# EAGLE design ponte_h_mosfet (EAGLE 6.5.0)
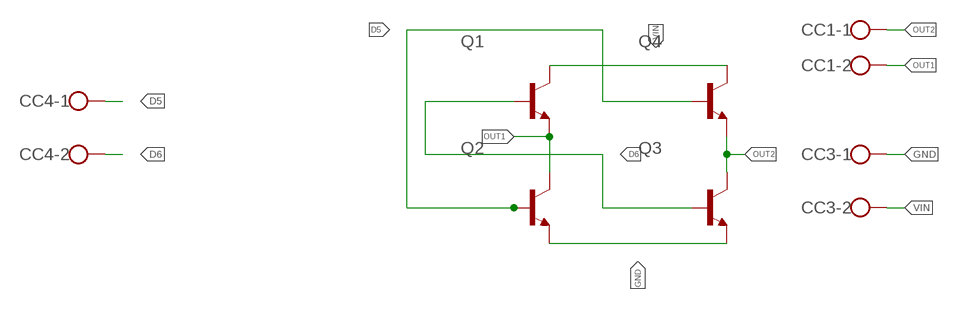
[diagram p0: schematic, sheet 1]

## Parts
CC1  W237-102  [W237-102]
CC3  W237-102  [W237-102]
CC4  W237-102  [W237-102]
Q1  -NPN-TO220V  [TO220V]
Q2  -NPN-TO220V  [TO220V]
Q3  -NPN-TO220V  [TO220V]
Q4  -NPN-TO220V  [TO220V]

## Nets
D5: CC4.1 Q2.1(B) Q4.1(B)
D6: CC4.2 Q1.1(B) Q3.1(B)
GND: CC3.1 Q2.3(E) Q3.3(E)
OUT1: CC1.2 Q1.3(E) Q2.2(C)
OUT2: CC1.1 Q3.2(C) Q4.3(E)
VIN: CC3.2 Q1.2(C) Q4.2(C)

## Library data of the parts
CC1 CC3 CC4 = con-wago-500:W237-102: WAGO SCREW CLAMP; MPN: 237-102; OC_FARNELL: unknown; OC_NEWARK: 70K9898
Q1-Q4 = transistor:*-NPN-: NPN Transistror BF959 corrected 2008.03.06

## Board
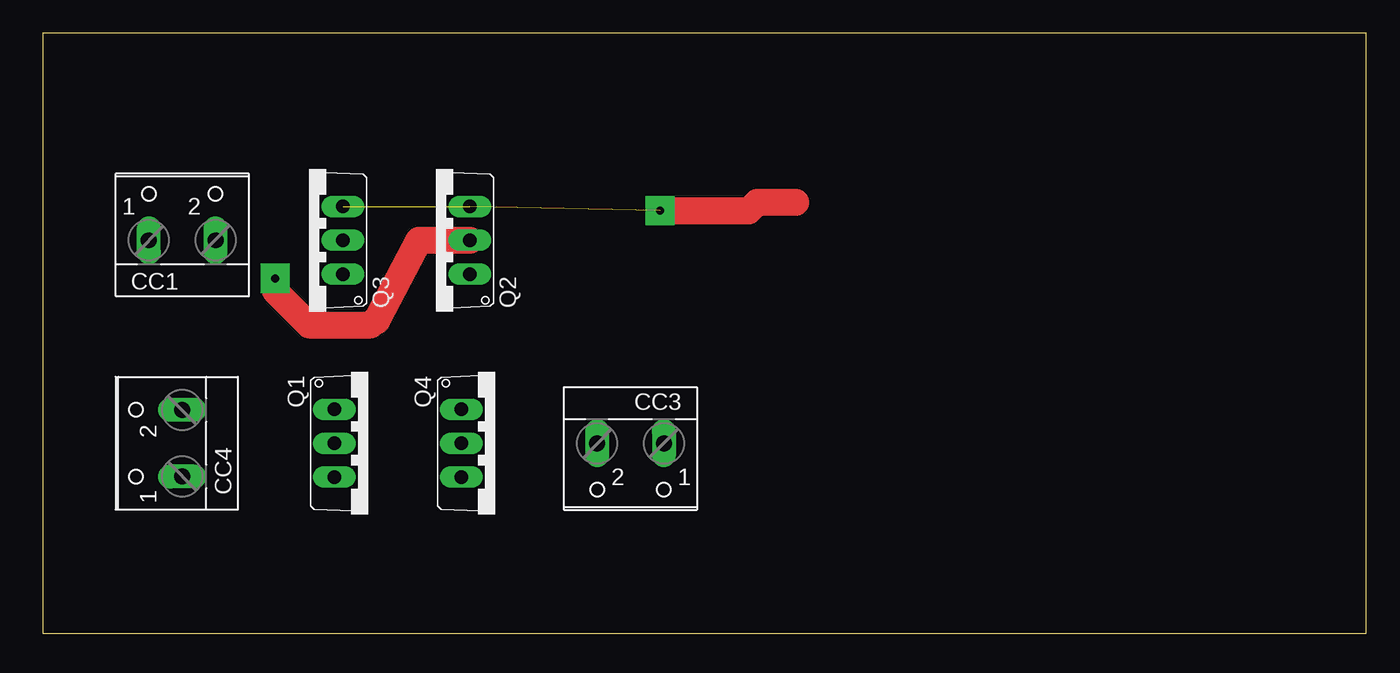
[diagram p1: board, top side]
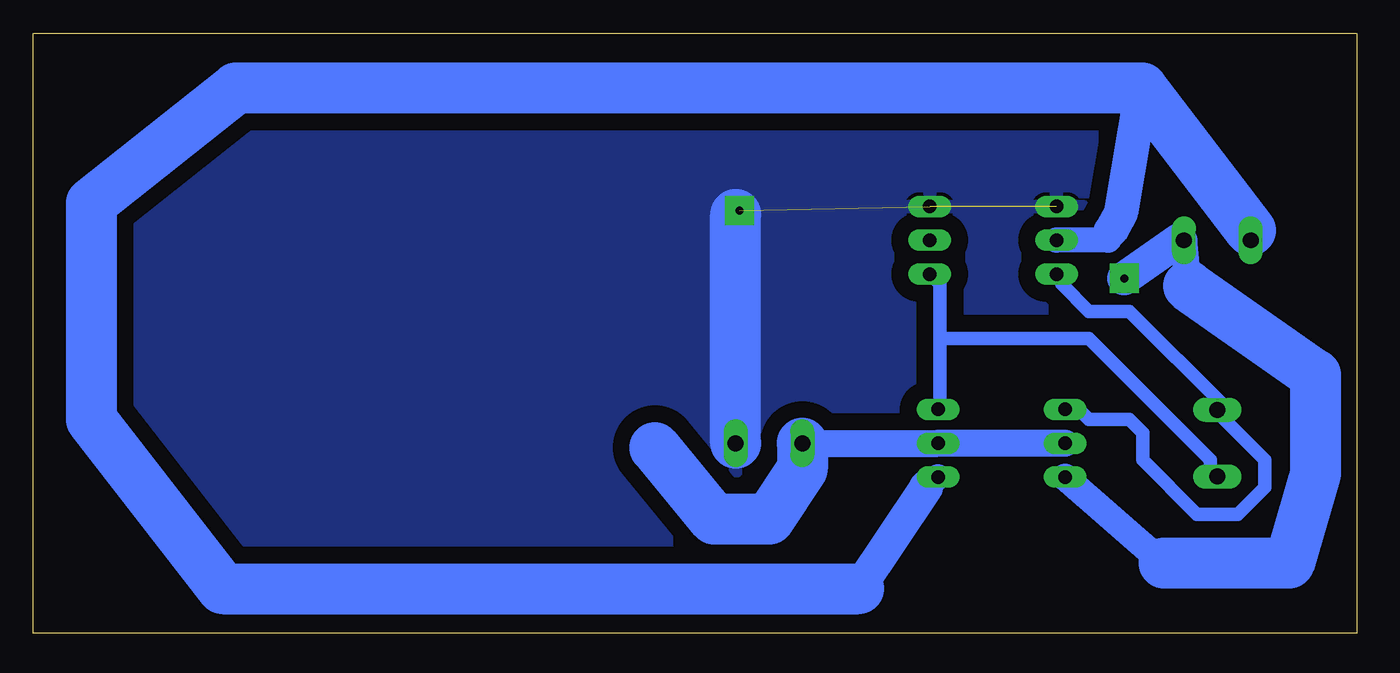
[diagram p2: board, bottom side, seen from below]

Size 99.36 x 45.07 mm. Coordinates in mm from the lower left corner, seen from the top.
Outline: 0,0 99.36,0 99.36,45.07 0,45.07 0,0
Copper layers (1*16): Top 0.035mm / dielectric 1.5mm / Bottom 0.035mm
Design rules "default *": minimum track width 40mil, minimum drill 24mil, track to track 20mil, track to pad 20mil, pad to pad 20mil, via to via 20mil, smd to smd 8mil, copper to edge 40mil, drill to drill 8mil, minimum pad ring 12mil, minimum via ring 8mil, stop-mask expansion 4mil, vias tented up to drill 0mil, thermal gap 10mil

### Footprints (pad centres in the part's own frame; a part is rotated, then mirrored left to right if it is on the bottom)
W237-102 = drill 1.194 long: 1 -2.5,-1.27; 2 2.5,-1.27
TO220V = drill 1.016 long: 1 -2.54,-2.54; 2 0,-2.54; 3 2.54,-2.54

### Placement (x,y rotation side)
CC1  10.48,30.8 0 top
CC3  44.13,13.02 180 top
CC4  9.21,14.29 90 top
Q1  24.45,14.29 270 top
Q2  29.53,29.53 90 top
Q3  20,29.53 90 top
Q4  33.97,14.29 270 top

### Tracks (layer width: path | path; a pad name or v marks a point on that pad's centre or on a via)
D5
  Bottom 1.016: 31.31,22.16 31.31,26.23 Q2.1 | 31.31,22.16 31.31,17.08 Q4.1 | 31.31,22.16 20.13,22.16 10.99,13.02 10.99,12 CC4.1
D6
  Bottom 1.016: Q1.1 21.15,17.08 20.13,16.07 17.08,16.07 16.07,15.05 16.07,13.02 12,8.95 8.95,8.95 6.92,10.99 6.92,13.02 9.97,16.07 CC4.2 9.97,17.08 17.08,24.19 20.13,24.19 22.16,26.23 Q3.1
GND  (via drill 0.6 pad 2.18)  (2 unrouted)
  Top 2.032: v46.35,31.75 53.02,31.75 53.66,32.38 56.51,32.38
  Bottom 2.032: 46.63,31.47 v46.35,31.75
  Bottom 3.81: CC3.1 46.63,31.47
  pour Bottom (isolate 1.27): 0.63,44.77 1.27,0 99.69,0 98.74,45.09
OUT1  (via drill 0.6 pad 2.18)
  Top 2.032: 25.08,23.49 25.22,23.76 | 25.22,23.76 28.26,29.53 Q2.2 | v17.46,26.67 17.46,25.72 20,23.18 24.64,23.18 25.22,23.76
  Bottom 2.032: 14.48,5.27 Q1.3 | 12.64,26.1 CC1.2 13.34,29.53
  Bottom 2.54: 13.34,29.53 v17.46,26.67
  Bottom 3.81: 14.48,5.27 5.08,5.27 3.11,12 3.11,19.43 12.64,26.1
OUT2
  Bottom 1.93: 32.32,10.99 Q4.3 | 18.67,29.59 Q3.2
  Bottom 2.032: 18.48,30.23 18.67,29.59
  Bottom 2.54: 37.4,3.37 32.32,10.99 | 8,30.29 CC1.1 | 18.48,30.23 17.72,31.62 16.13,40.96
  Bottom 3.81: 37.4,3.37 85.15,3.37 95,16.07 95,32.32 84.14,40.96 16.13,40.96 8,30.29
VIN
  Bottom 2.032: CC3.2 Q4.2 Q1.2
  Bottom 3.81: CC3.2 41.63,12.34 44.13,8.57 48.26,8.57 52.7,13.97